# EAGLE design AXAWIFI (EAGLE 9.6.2)
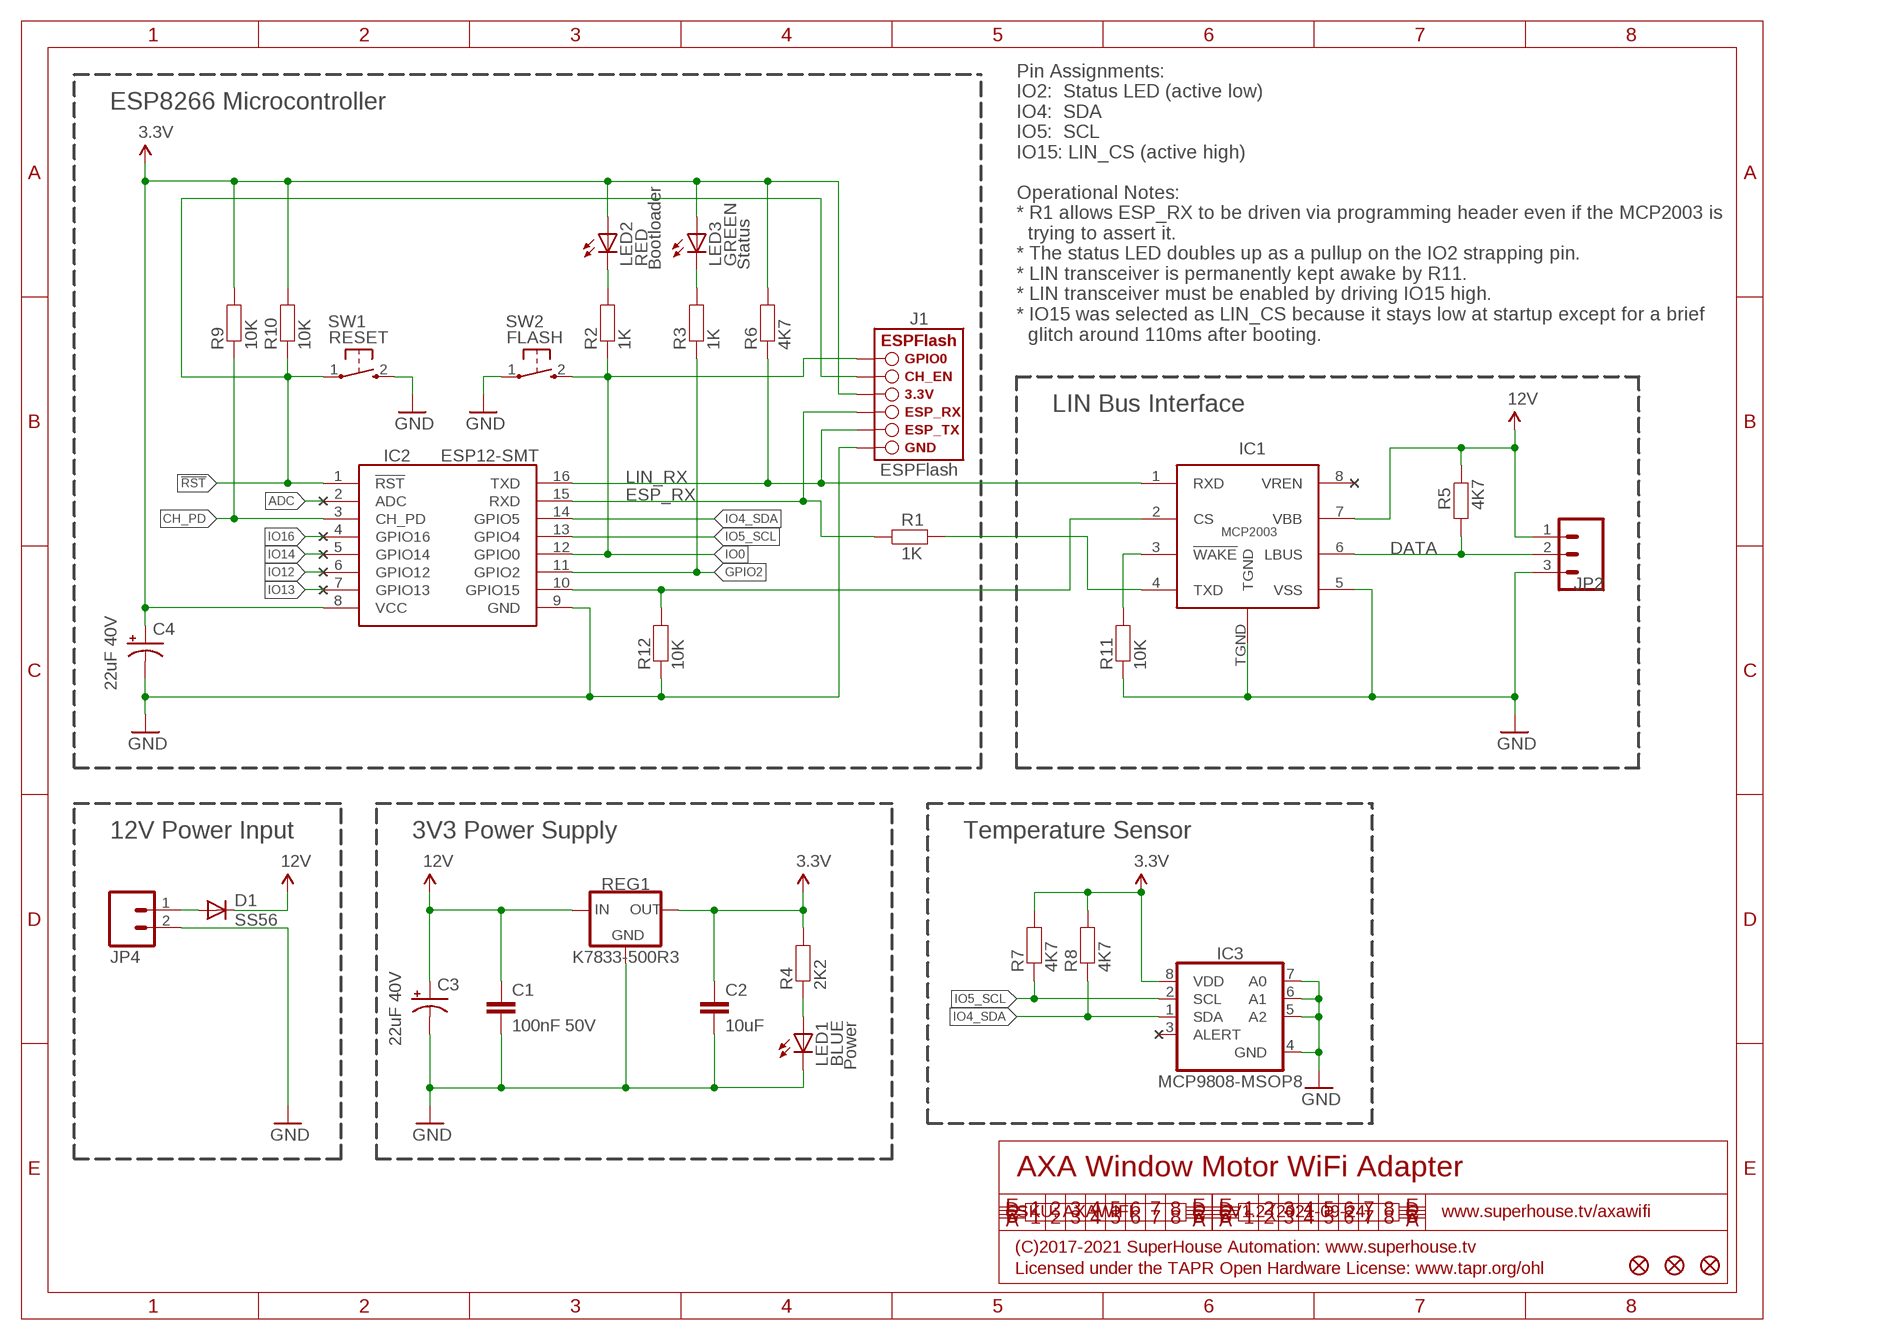
[diagram p0: schematic, sheet 1]

## Parts
C1  100nF 50V  CAP0603  [C0603]
C2  10uF  CAP0805  [C0805]
C3  22uF 40V  CAP_POLC  [PANASONIC_C]
C4  22uF 40V  CAP_POLC  [PANASONIC_C]
D1  SS56  DIODESMA  [SMA-DIODE]
FID1  FIDUCIAL1X2.5  [FIDUCIAL-1X2.5]
FID2  FIDUCIAL1X2.5  [FIDUCIAL-1X2.5]
FID3  FIDUCIAL1X2.5  [FIDUCIAL-1X2.5]
IC1  MCP2003  [SOIC8T]
IC2  ESP12-SMT  [ESP12]
IC3  MCP9808-MSOP8  [MSOP-8]
J1  ESPFLASH-1X6-2.54-SOCKET  [1X6-2.54-SOCKET]
JP2  M03-PLAIN  [1X03]
JP4  M02-SCREW-3.5MM  [SCREWTERMINAL-3.5MM-2]
LED1  BLUE  LED0603  [LED-0603]
LED2  RED  LED0603  [LED-0603]
LED3  GREEN  LED0603  [LED-0603]
R1  1K  RESISTOR0603  [R0603]
R2  1K  RESISTOR0603  [R0603]
R3  1K  RESISTOR0603  [R0603]
R4  2K2  RESISTOR0603  [R0603]
R5  4K7  RESISTOR0603  [R0603]
R6  4K7  RESISTOR0603  [R0603]
R7  4K7  RESISTOR0603  [R0603]
R8  4K7  RESISTOR0603  [R0603]
R9  10K  RESISTOR0603  [R0603]
R10  10K  RESISTOR0603  [R0603]
R11  10K  RESISTOR0603  [R0603]
R12  10K  RESISTOR0603  [R0603]
REG1  K7833-500R3  78XX-K78XX-VERTICAL  [K78XX-500R3]
SW1  RESET  TAC_SWITCH_2PINSMT  [TACTILE_SMT_3X4X2]
SW2  FLASH  TAC_SWITCH_2PINSMT  [TACTILE_SMT_3X4X2]

## Nets
3.3V: C2.1 C4.+ IC2.8(VCC) IC3.8(VDD) J1.4(3.3V) LED2.A LED3.A R4.2 R6.2 R7.2 R8.2 R9.2 R10.2 REG1.3(OUT)
12V: C1.1 C3.+ D1.C IC1.7(VBB) JP2.1 R5.2 REG1.1(IN)
!LIN_WAKE: IC1.3(!WAKE) R11.2
!RST: IC2.1(!RST) J1.5(CH_EN) R10.1 SW1.1(P)
ADC: IC2.2(ADC)
CH_PD: IC2.3(CH_PD) R9.1
DATA: IC1.6(LBUS) JP2.2 R5.1
ESP_RX: IC2.15(RXD) J1.3(ESP_RX) R1.1
GND: C1.2 C2.2 C3.- C4.- IC1.5(VSS) IC1.TGND IC2.9(GND) IC3.4(GND) IC3.5(A2) IC3.6(A1) IC3.7(A0) J1.1(GND) JP2.3 JP4.2 LED1.C R11.1 R12.1 REG1.2(GND) SW1.2(S) SW2.1(P)
GPIO2: IC2.11(GPIO2) R3.1
GPIO15: IC1.2(CS) IC2.10(GPIO15) R12.2
IO0: IC2.12(GPIO0) J1.6(GPIO0) R2.1 SW2.2(S)
IO4_SDA: IC2.14(GPIO5) IC3.1(SDA) R8.1
IO5_SCL: IC2.13(GPIO4) IC3.2(SCL) R7.1
IO12: IC2.6(GPIO12)
IO13: IC2.7(GPIO13)
IO14: IC2.5(GPIO14)
IO16: IC2.4(GPIO16)
LIN_RX: IC1.1(RXD) IC2.16(TXD) J1.2(ESP_TX) R6.1
N$1: D1.A JP4.1
N$2: IC1.4(TXD) R1.2
N$3: LED3.C R3.2
N$14: LED1.A R4.1
N$20: LED2.C R2.2
Unconnected: IC1.8(VREN) IC3.3(ALERT)

## Notes on the sheet
- ESP8266 Microcontroller
- Bootloader | Status
- Pin Assignments:
  IO2:  Status LED (active low)
  IO4:  SDA
  IO5:  SCL
  IO15: LIN_CS (active high)
  
  Operational Notes:
  * R1 allows ESP_RX to be driven via programming header even if the MCP2003 is
    trying to assert it.
  * The status LED doubles up as a pullup on the IO2 strapping pin.
  * LIN transceiver is permanently kept awake by R11.
  * LIN transceiver must be enabled by driving IO15 high.
  * IO15 was selected as LIN_CS because it stays low at startup except for a brief
    glitch around 110ms after booting.
- LIN Bus Interface
- 12V Power Input | 3V3 Power Supply | Temperature Sensor
- Power
- AXA Window Motor WiFi Adapter
- SKU: AXAWIFI | V1.2 (2021-09-24) | www.superhouse.tv/axawifi
- (C)2017-2021 SuperHouse Automation: www.superhouse.tv
- Licensed under the TAPR Open Hardware License: www.tapr.org/ohl

## Library data of the parts
C1 C2 = SuperHouse-Capacitors:CAP: Capacitor Standard ceramic capacitor
C3 C4 = SuperHouse-Capacitors:CAP_POL: Capacitor Polarized These are standard SMD and PTH capacitors. Normally 10uF, 47uF, and 100uF in electrolytic and tantalum varieties. Always verify the external diameter of the through hole cap, it varies with capacity, voltage, and manufacturer. The EIA devices should be standard.
D1 = SuperHouse-Diodes:DIODE: Diode Standard reverse protection diodes and small signal diodes. SMA package can handle up to about 1A. SOD-323 can handle about 200mA.
FID1-FID3 = SuperHouse-Symbols:FIDUCIAL: Fiducial Alignment Points Various fiducial points for machine vision alignment.
IC1 = SuperHouse-ICs:MCP2003: MCP2003 LIN bus driver
IC2 = SuperHouse-MCUs:ESP12: ESP-12 module
IC3 = SuperHouse-Sensors:MCP9808: Microchip MCP9808 I2C temperature sensor
J1 = SuperHouse-ESPFlash:ESPFLASH: ESPFlash ESPFlash programming header for ESP8266, ESP8285, and ESP32. Options for both 1x6 and 2x3 formats, in both 2.54mm (0.1") and 1.27mm (0.05") pitch.
JP2 = SuperHouse-Connectors:M03: 3-way header Standard 1x3 header, and screw terminal variations
JP4 = SuperHouse-Connectors:M02: 2-way header Standard 1x2 header, and screw terminal variations
LED1-LED3 = SuperHouse-LEDs:LED: LEDs in various sizes including 5mm and 3mm PTH, and 0402, 0603, 0805, etc SMT
R1-R12 = SuperHouse-Resistors:RESISTOR: Resistors in both surface-mount and through-hole versions.
REG1 = SuperHouse-Regulators:78XX: L78xx (linear) and K78xx (switching) voltage regulators
SW1 SW2 = SuperHouse-Switches:TAC_SWITCH_2PIN: Momentary Tactile Switch - 2 pin Uxcell 3x4x2mm switch with 2 SMT pads

## Board
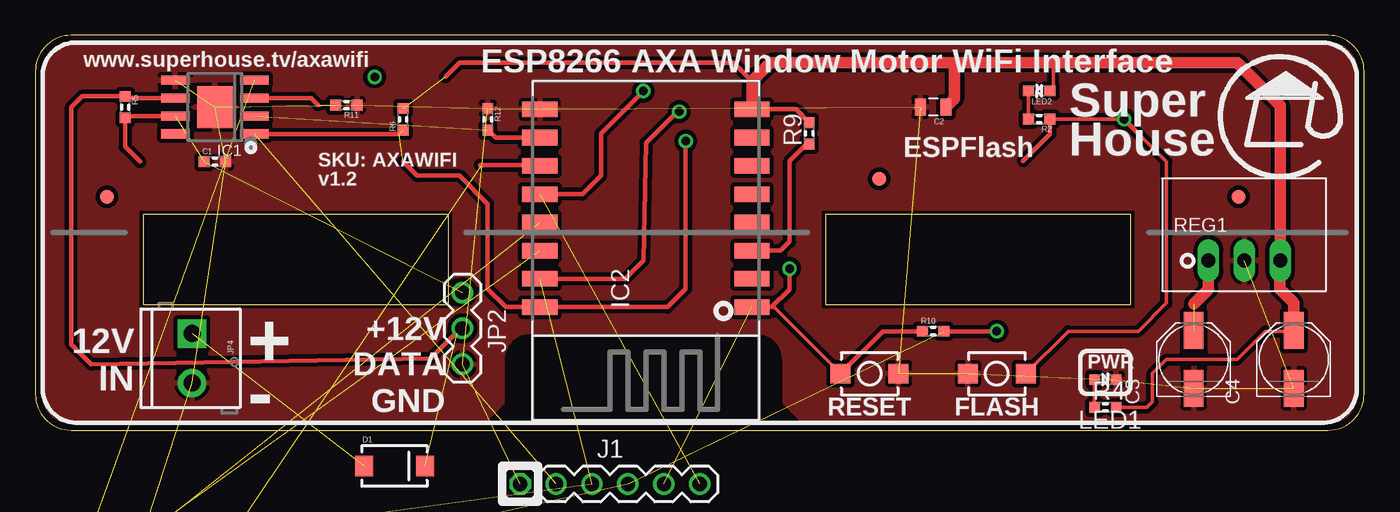
[diagram p1: board, top side]
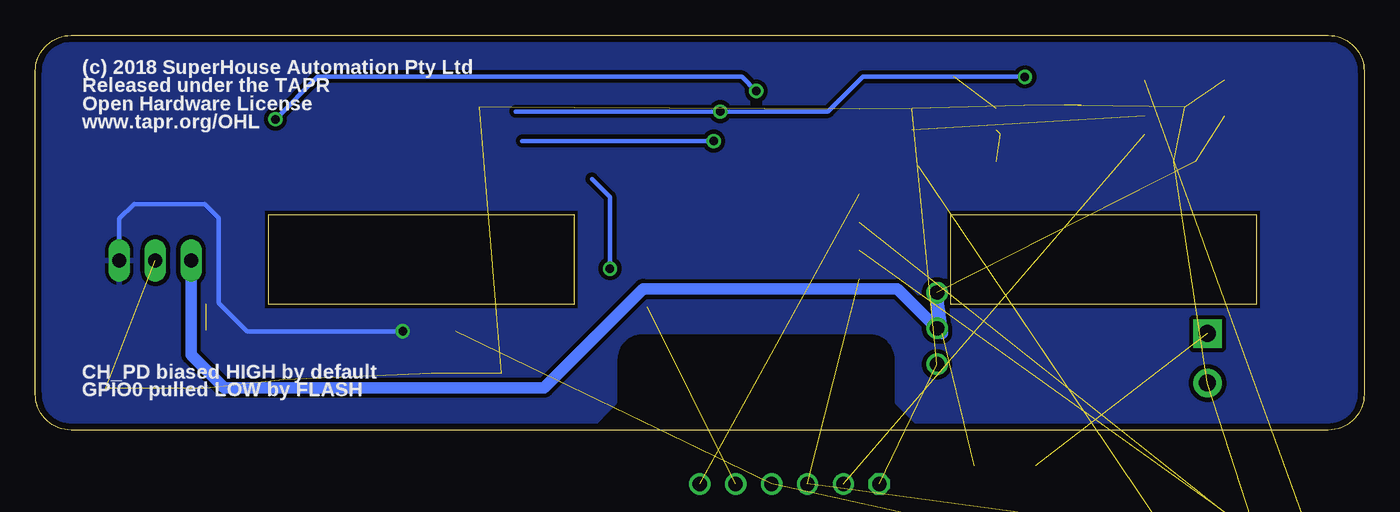
[diagram p2: board, bottom side, seen from below]

Size 93.98 x 27.94 mm. Coordinates in mm from the lower left corner, seen from the top.
Outline: 0,2.54 arc90 2.54,0 91.44,0 arc90 93.98,2.54 93.98,25.4 arc90 91.44,27.94 2.54,27.94 arc90 0,25.4 0,2.54
Copper layers (1*16): Top 0.035mm / dielectric 1.5mm / Bottom 0.035mm
Design rules "default *": minimum track width 10mil, minimum drill 24mil, track to track 12mil, track to pad 12mil, pad to pad 12mil, via to via 12mil, smd to smd 8mil, copper to edge 18mil, drill to drill 8mil, minimum pad ring 10mil, minimum via ring 8mil, stop-mask expansion 3mil, vias tented up to drill 24mil, thermal gap 10mil
tRestrict: area 7.4,8.6 to 29.5,15.5; area 55.6,8.6 to 77.7,15.5
bRestrict: area 7.4,8.6 to 29.5,15.5; area 55.6,8.6 to 77.7,15.5
Milling: 8 lines

### Footprints (pad centres in the part's own frame; a part is rotated, then mirrored left to right if it is on the bottom)
C0603 = smd 0.762 x 0.762: 1 -0.762,0; 2 0.762,0
C0805 = smd 0.8 x 1.2: 1 -0.9,0; 2 0.9,0
PANASONIC_C = smd 2.6 x 1.4: + 2.05,0; - -2.05,0
SMA-DIODE = smd 1.27 x 1.47: A -2.15,0; C 2.15,0
FIDUCIAL-1X2.5 = smd 1 x 1: 1 0,0
SOIC8T = smd 2.032 x 0.66: 1 -2.794,1.905; 2 -2.794,0.635; 3 -2.794,-0.635; 4 -2.794,-1.905; 5 2.794,-1.905; 6 2.794,-0.635; 7 2.794,0.635; 8 2.794,1.905 | smd 2.489 x 2.997: TGND 0,0
ESP12 = smd 1.1 x 2.5: 1 -4,-7.5; 2 -2,-7.5; 3 0,-7.5; 4 2,-7.5; 5 4,-7.5; 6 6,-7.5; 7 8,-7.5; 8 10,-7.5; 9 10,7.5; 10 8,7.5; 11 6,7.5; 12 4,7.5; 13 2,7.5; 14 0,7.5; 15 -2,7.5; 16 -4,7.5
MSOP-8 = smd 1.45 x 0.45: 1 -2.2,0.975; 2 -2.2,0.325; 3 -2.2,-0.325; 4 -2.2,-0.975; 5 2.2,-0.975; 6 2.2,-0.325; 7 2.2,0.325; 8 2.2,0.975
1X6-2.54-SOCKET = drill 1 octagon: 1 -6.35,0 | drill 1: 2 -3.81,0; 3 -1.27,0; 4 1.27,0; 5 3.81,0; 6 6.35,0
1X03 = drill 1.016: 1 -2.54,0; 2 0,0; 3 2.54,0
SCREWTERMINAL-3.5MM-2 = drill 1.2 pad 2.032 square: 1 -1.75,0 | drill 1.2 pad 2.032: 2 1.75,0
LED-0603 = smd 0.762 x 0.762: A -0.762,0; C 0.762,0
R0603 = smd 0.762 x 0.762: 1 -0.762,0; 2 0.762,0
K78XX-500R3 = drill 1 long: 1 -2.54,0; 2 0,0; 3 2.54,0
TACTILE_SMT_3X4X2 = smd 1.4 x 1.4: 1 -2.05,0; 2 2.05,0

### Placement (x,y rotation side)
C1  12.7,19 0 top
C2  63.5,22.86 180 top
C3  81.92,5 90 top
C4  89,5 90 top
D1  25.4,-2.54 0 top
FID1  85.09,16.51 0 top
FID2  5.08,16.51 0 top
FID3  59.69,17.78 0 top
IC1  12.7,22.86 180 top
IC2  43.18,12.7 90 top
IC3  3.81,-12.7 0 top  (outside the outline)
J1  40.64,-3.81 0 top  (outside the outline)
JP2  30.21,7.2 270 top
JP4  11.08,5.08 270 top
LED1  75.67,3.57 0 top
LED2  71,24 180 top
LED3  2.54,-22.86 0 top  (outside the outline)
R1  2.54,-8.89 0 top  (outside the outline)
R2  71,22 180 top
R3  2.54,-25.4 0 top  (outside the outline)
R4  75.67,1.62 0 top
R5  6.35,22.86 270 top
R6  26,22 90 top
R7  2.54,-19.05 0 top  (outside the outline)
R8  2.54,-16.51 0 top  (outside the outline)
R9  54.73,21 90 top
R10  63.5,7 0 top
R11  22,23 180 top
R12  32,22 270 top
REG1  85.5,12 0 top
SW1  59,4 0 top
SW2  68,4 0 top

### Tracks (layer width: path | path; a pad name or v marks a point on that pad's centre or on a via)
3.3V  (via drill 0.6)  (6 unrouted)
  Top 0.254: LED2.A 72,24.24 72,26 | R4.2 78.62,1.62 79,2 79,4 80,5 85,5 87,7 89,7 C4.+
  Top 0.305: 29,25 30,26 49.36,26 50.68,24.68 | R10.2 v68,7 | R9.2 53.79,22.7 IC2.8
  Top 0.813: 65,26 72,26 85,26 88.04,22.96 REG1.3 88,11.96 88,10 89,9 C4.+ | 65,26 52,26 50.68,24.68 IC2.8 | C2.1 65,23.46 65,26
  Bottom 0.305: v68,7 79,7 81,9 81,15 82,16 87,16 88.04,14.96 REG1.3
  pour Bottom: 0,25.4 arc-90 2.54,27.94 91.44,27.94 arc-90 93.98,25.4 93.98,2.54 arc-90 91.44,0 55,0 53,2 53,5 arc90 51,7 35,7 arc90 33,5 33,2 31,0 2.54,0 arc-90 0,2.54
12V  (4 unrouted)
  Top 0.305: IC1.7 6.48,22.23 R5.2 6.35,20.05 7.4,19
  Top 0.813: REG1.1 82.96,9.96 81.92,8.92
  Bottom 0.813: REG1.1 82.96,5.34 80.62,3 58,3 51,10 33,10 30.21,7.21 JP2.1 29.84,6.83
!LIN_WAKE  (1 unrouted)
  Top 0.305: IC1.3 19.5,23.5 20,23
!RST  (via drill 0.6)  (1 unrouted)
  Top 0.254: SW1.1 52.25,8.7
  Top 0.305: R10.1 59.95,7 SW1.1 | IC2.1 52.07,8.7 | 52.07,8.7 52.25,8.7 | v53.34,11.43 53.34,9.97 52.07,8.7
  Bottom 0.305: 54.61,17.78 53.34,16.51 v53.34,11.43
CH_PD
  Top 0.305: IC2.3 52.7,12.7 53.34,13.34 53.34,19.05 54.53,20.24 R9.1
DATA
  Top 0.305: IC1.6 6.48,23.5 R5.1 3.3,23.62 2.54,22.86 2.54,6.08 3.96,4.66 27.94,5.08 30.06,7.2 JP2.2
ESP_RX  (via drill 0.6)  (2 unrouted)
  Top 0.305: v45.54,22.54 45.4,22.54 43.18,20.32 43,12 41.7,10.7 IC2.15
  Bottom 0.305: v24,25 35.46,25 37.92,22.54 v45.54,22.54 60.01,22.54
GND  (19 unrouted)
  pour Top: 0,25.4 arc-90 2.54,27.94 91.44,27.94 arc-90 93.98,25.4 93.98,2.54 arc-90 91.44,0 55,0 53,2 53,5 arc90 51,7 35,7 arc90 33,5 33,2 31,0 2.54,0 arc-90 0,2.54
GPIO2  (1 unrouted)
  Top 0.305: 31.54,18.7 31.47,18.77 35.61,18.77 IC2.11
GPIO15  (1 unrouted)
  Top 0.305: R12.2 32.54,20.7 IC2.10
IO0  (via drill 0.6)  (1 unrouted)
  Top 0.254: SW2.2 73.05,7 78,7 80,9 80,19 78,21 | v77,22 R2.1
  Top 0.305: v43,24 40,21 40,18 38.7,16.7 IC2.12 | v77,22 78,21 | R2.1 71.76,20.96 69.85,19.05
  Bottom 0.305: v43,24 44,25 74,25 v77,22
IO4_SDA  (2 unrouted)
IO5_SCL  (2 unrouted)
LIN_RX  (via drill 0.6)  (3 unrouted)
  Top 0.305: v46,20.46 46,10 44.7,8.7 IC2.16 33.3,8.7 32,10 32,16 30,18 27,18 26,19 | IC1.1 25.72,20.95
  Bottom 0.305: v46,20.46 59.55,20.46
N$1  (1 unrouted)
N$2  (1 unrouted)
N$3  (1 unrouted)
N$14
  Top 0.254: LED1.A R4.1
N$20
  Top 0.254: R2.2 LED2.C

### Text on the board
tPlace: www.superhouse.tv/axawifi | ESP8266 AXA Window Motor WiFi Interface | ESPFlash | Super / House | SKU: AXAWIFI / v1.2 | +12V | 12V / IN | DATA | + | PWR | GND | - | RESET | FLASH
bPlace: (c) 2018 SuperHouse Automation Pty Ltd / Released under the TAPR / Open Hardware License / www.tapr.org/OHL | CH_PD biased HIGH by default / GPIO0 pulled LOW by FLASH
tDocu: A | K | A | K